# EAGLE design Adafruit JTAG to SWD Adapter (EAGLE 6.6.0)
CHECKED: KTOWN; COMPANY: ADAFRUIT INDUSTRIES; DRAWN: KTOWN; REV: A
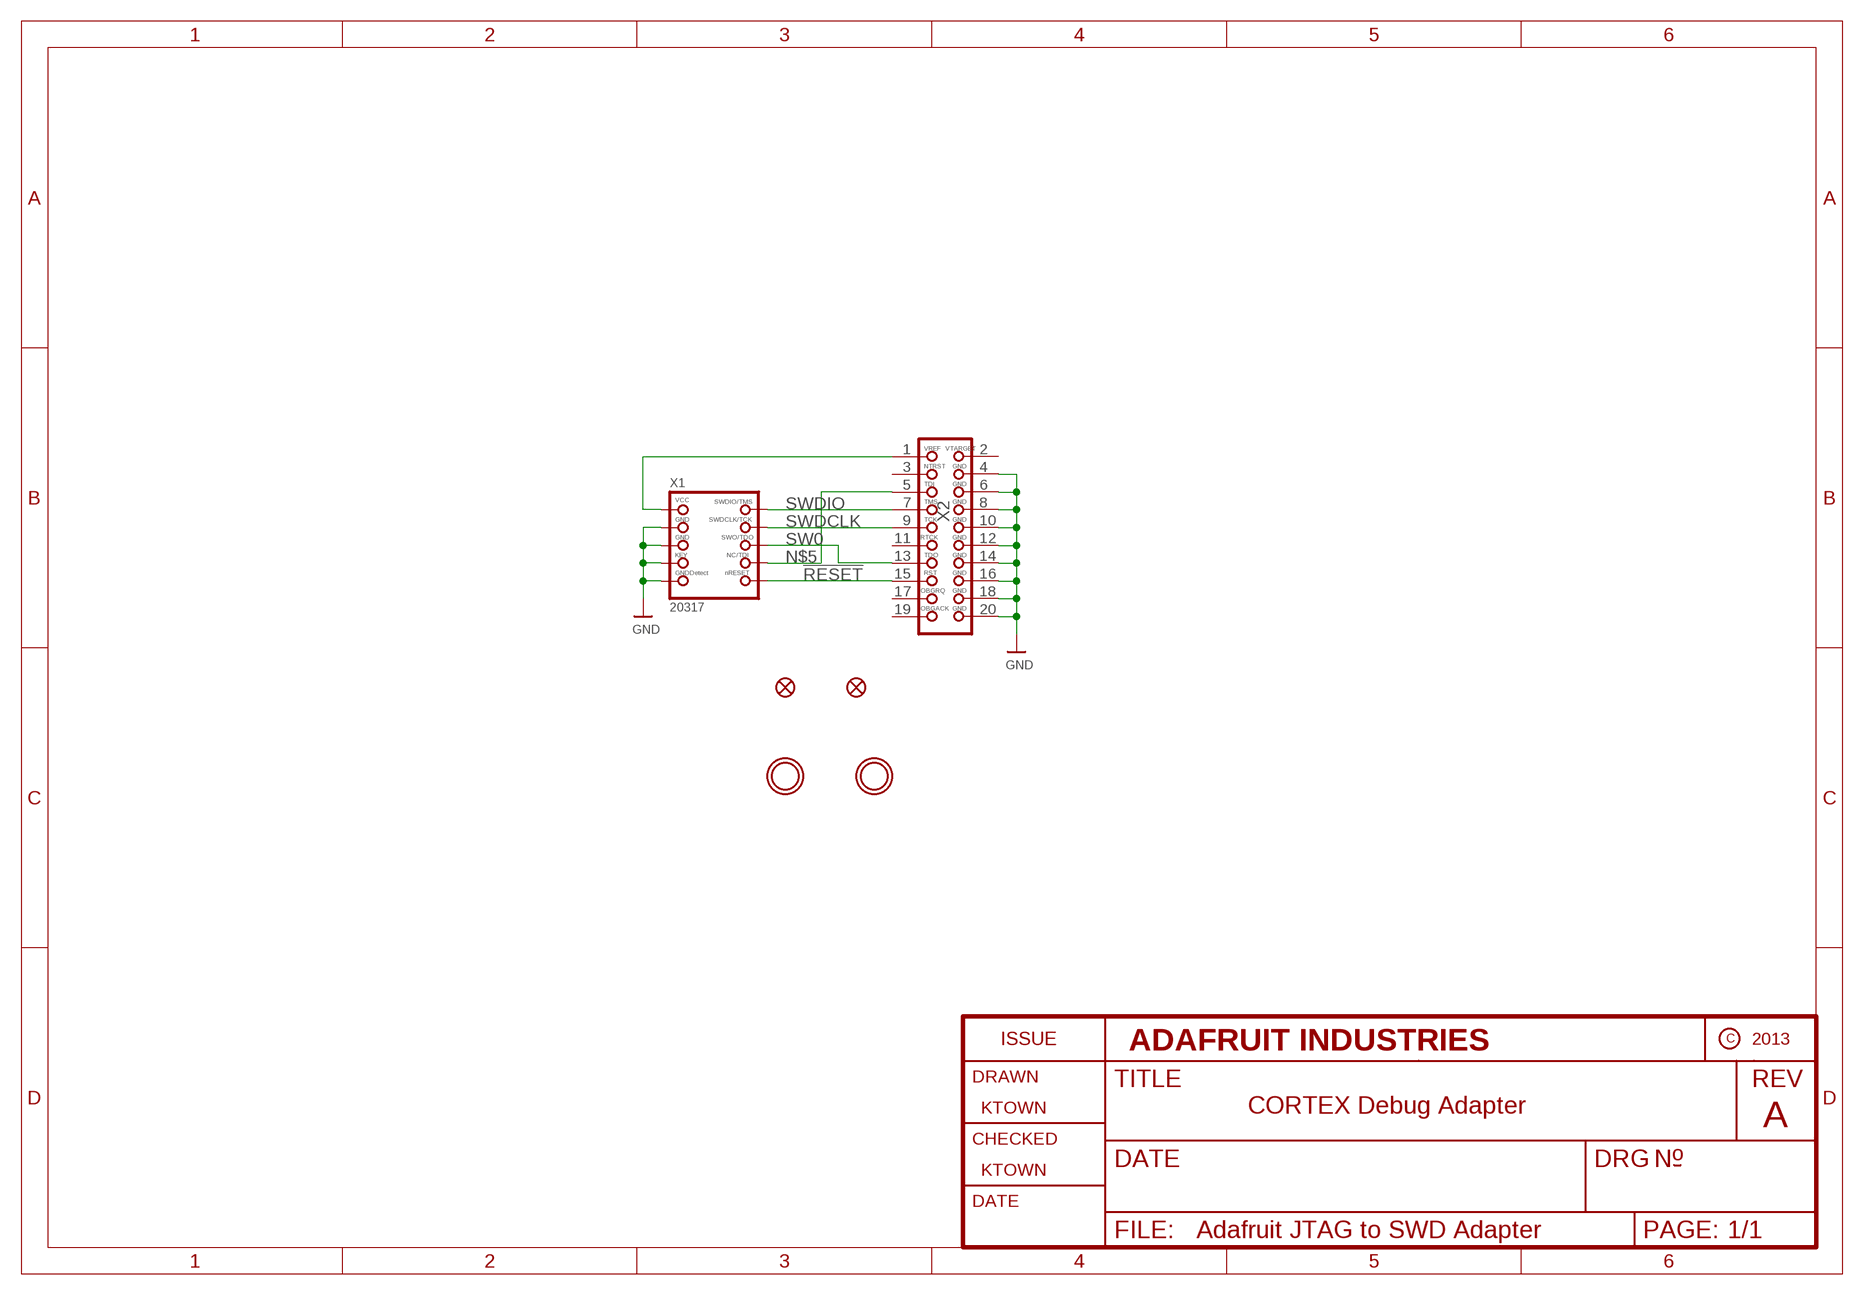
[diagram p0: schematic, sheet 1]

## Parts
FID1  FIDUCIAL""  [FIDUCIAL_1MM]
FID2  FIDUCIAL""  [FIDUCIAL_1MM]
U$5  MOUNTINGHOLE2.5  [MOUNTINGHOLE_2.5_PLATED]
U$6  MOUNTINGHOLE2.5  [MOUNTINGHOLE_2.5_PLATED]
X1  20317  JTAG-CORTEXBOXPOSTS  [2X05_1.27MM_BOX_POSTS]
X2  03587  JTAG-ARM7SMT_FEMALE  [2X10_SMT_FEMALE]

## Nets
!RESET: X1.10(NRESET) X2.15
GND: X1.3(GND) X1.5(GND) X1.7(KEY) X1.9(GNDDETECT) X2.4 X2.6 X2.8 X2.10 X2.12 X2.14 X2.16 X2.18 X2.20
N$5: X1.8(TDI) X2.5
SW0: X1.6(SWO) X2.13
SWDCLK: X1.4(SWDCLK) X2.9
SWDIO: X1.2(SWDIO) X2.7
VCC: X1.1(VCC) X2.1
Unconnected: X2.2 X2.3 X2.11 X2.17 X2.19

## Notes on the sheet
- CORTEX Debug Adapter

## Library data of the parts
FID1 FID2 = microbuilder:FIDUCIAL: Fiducial Alignment Points Various fiducial points for machine vision alignment.; BOM: EXCLUDE
U$5 U$6 = microbuilder:MOUNTINGHOLE: Mounting Hole For #2 screws (0.086"/2.18mm width, 0.094"/2.4mm hole) use 2.5mm; BOM: EXCLUDE
X1 = microbuilder:JTAG-CORTEX: Serial Wire (SW-DP) Connector Standard 0.05" 10-pin connector is for use with the Cortex M and Cortex A SWD (serial wire debugger) interface (SW-DP) Connectors 2x05_1.27MM_SMT - Inexpensive surface-mount header with bare pins, compatible with standard 10-pin SWD cables (4UCON: 16846) 2x05_1.27MM_BOX_NOPOSTS - Polarised surface-mount box (4UCON with caps: 19735, without caps: 15117 2x05_1.27MM_BOX_POSTS - Polarised surface-mount box with mounting holes (4UCON: 20317) Pinout: http://infocenter.arm.com/help/topic/com.arm.doc.faqs/attached/13634/cortex_debug_connectors.pdf http://www.keil.com/peripherals/coresight/connectors.asp
X2 = microbuilder:JTAG-ARM7: 20 Pin JTAG Connector For use with ARM7, and ARM9. Supported by some Cortex M3 boards with SWJ-DP interfaces (dual SWP/JTAG support). PTH - 4UConnector: 03556 SMT_MALE - 4UConnector: 17654 SMT_FEMALE - 4UConnector: 03587

## Board
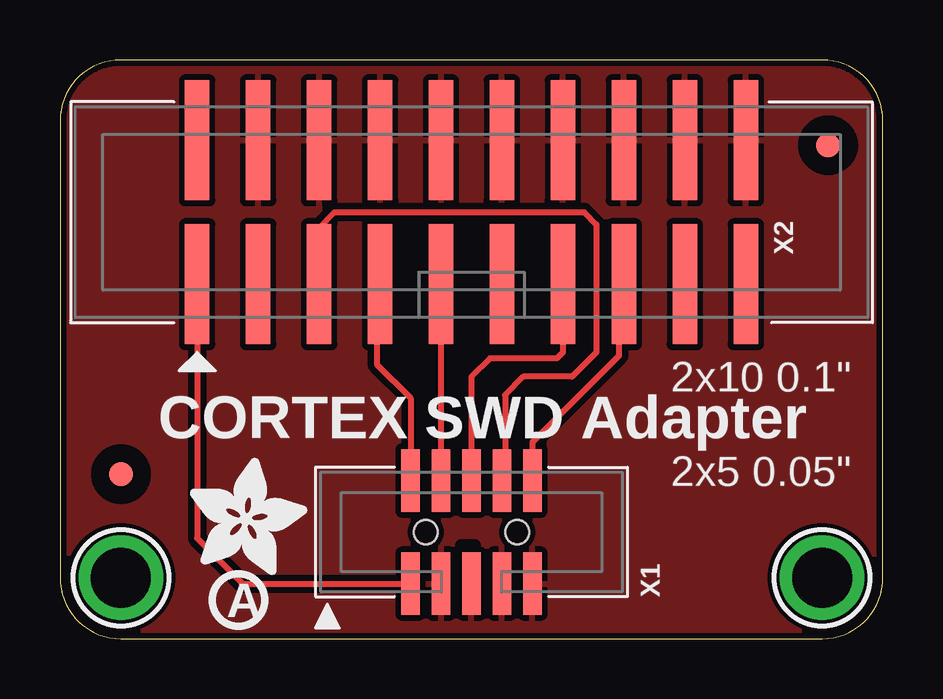
[diagram p1: board, top side]
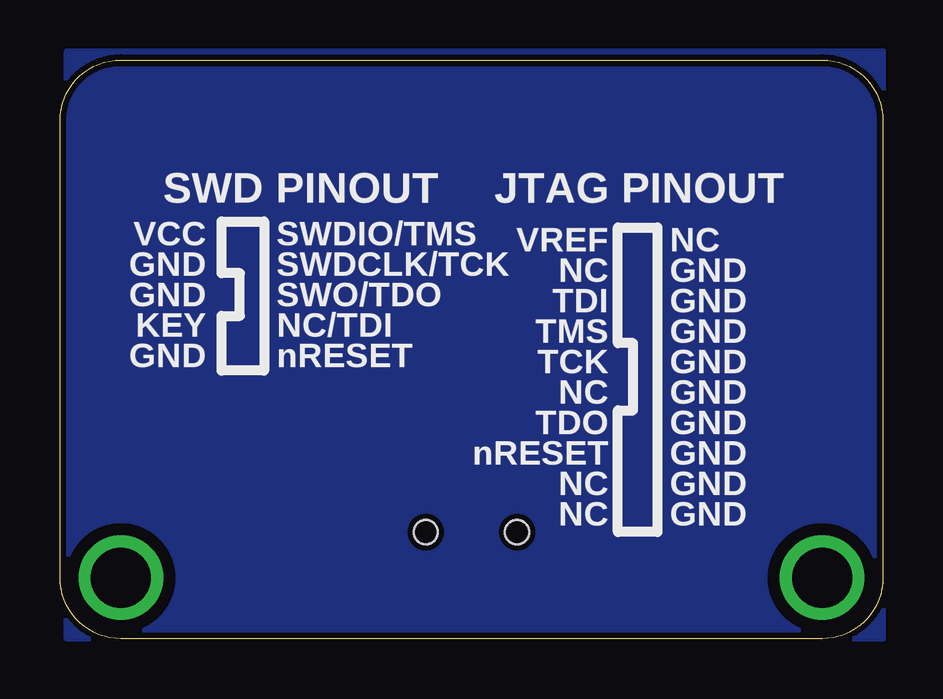
[diagram p2: board, bottom side, seen from below]

Size 34.29 x 24.13 mm. Coordinates in mm from the lower left corner, seen from the top.
Outline: 34.29,2.54 34.29,21.59 arc90 31.75,24.13 2.54,24.13 arc90 0,21.59 0,2.54 arc90 2.54,0 31.75,0 arc90 34.29,2.54
Copper layers (1*16): Top 0.035mm / dielectric 1.5mm / Bottom 0.035mm
Design rules "adafruit": minimum track width 8mil, minimum drill 15.5mil, track to track 8mil, track to pad 8mil, pad to pad 8mil, via to via 8mil, smd to smd 8mil, copper to edge 10mil, drill to drill 8mil, minimum pad ring 10mil, minimum via ring 8mil, stop-mask expansion 2mil, vias tented up to drill 20mil, thermal gap 10mil
tRestrict: area 18.9,2.1 to 19.1,2.6; area 17.6,2.1 to 17.8,2.7; area 16.4,2.1 to 16.6,2.7; area 16.7,3.8 to 17.3,3.9

### Footprints (pad centres in the part's own frame; a part is rotated, then mirrored left to right if it is on the bottom)
FIDUCIAL_1MM = smd 1 x 1: 1 0,0
MOUNTINGHOLE_2.5_PLATED = drill 2.5 pad 3.2: P$1 0,0
2X05_1.27MM_BOX_POSTS = smd 0.76 x 2.6: 1 -2.54,-2.15; 2 -2.54,2.15; 3 -1.27,-2.15; 4 -1.27,2.15; 5 0,-2.15; 6 0,2.15; 7 1.27,-2.15; 8 1.27,2.15; 9 2.54,-2.15; 10 2.54,2.15 | hole 1: -1.905,0; 1.905,0
2X10_SMT_FEMALE = smd 1.02 x 5: 1 -11.43,-3; 2 -11.43,3; 3 -8.89,-3; 4 -8.89,3; 5 -6.35,-3; 6 -6.35,3; 7 -3.81,-3; 8 -3.81,3; 9 -1.27,-3; 10 -1.27,3; 11 1.27,-3; 12 1.27,3; 13 3.81,-3; 14 3.81,3; 15 6.35,-3; 16 6.35,3; 17 8.89,-3; 18 8.89,3; 19 11.43,-3; 20 11.43,3

### Placement (x,y rotation side)
FID1  32,20.57 0 top
FID2  2.54,6.86 0 top
U$3  [ADAFRUIT_5MM]  5.42,2.67 0 top
U$4  [PCBFEAT-REV-056]  7.44,1.61 0 top
U$5  2.54,2.54 0 top
U$6  31.75,2.54 0 top
X1  17.14,4.45 0 top
X2  17.14,17.78 0 top

### Tracks (layer width: path | path; a pad name or v marks a point on that pad's centre or on a via)
!RESET
  Top 0.254: X2.15 23.3,14.7 23.3,11.8 19.68,8.19 X1.10
GND
  pour Top (isolate 0.254): 34,24.5 34,0 0,0 0,24.5
  pour Bottom (isolate 0.254): 34,0 34,24.5 0,24.5 0,0
N$5
  Top 0.254: X2.5 10.79,17.14 11.43,17.78 21.84,17.78 22.35,17.27 22.35,11.94 21.34,10.92 19.3,10.92 18.54,10.16 18.54,6.72 X1.8
SW0
  Top 0.254: X2.13 20.95,11.94 20.7,11.68 17.91,11.68 17.14,10.92 X1.6
SWDCLK
  Top 0.254: X1.4 X2.9
SWDIO
  Top 0.254: X2.7 13.2,14.74 13.2,11.44 14.61,10.03 X1.2
VCC
  Top 0.254: 14.41,2.3 X1.1 14.6,2.29 7.62,2.29 5.71,4.19 X2.1

### Text on the board
tPlace: 2x10 0.1" | CORTEX SWD Adapter | 2x5 0.05"
bPlace: JTAG PINOUT | SWD PINOUT | NC | VREF | SWDIO/TMS | VCC | SWDCLK/TCK | GND | GND | NC | GND | TDI | SWO/TDO | GND | GND | TMS | NC/TDI | KEY | GND | TCK | nRESET | GND | GND | NC | GND | TDO | GND | nRESET | GND | NC | GND | NC